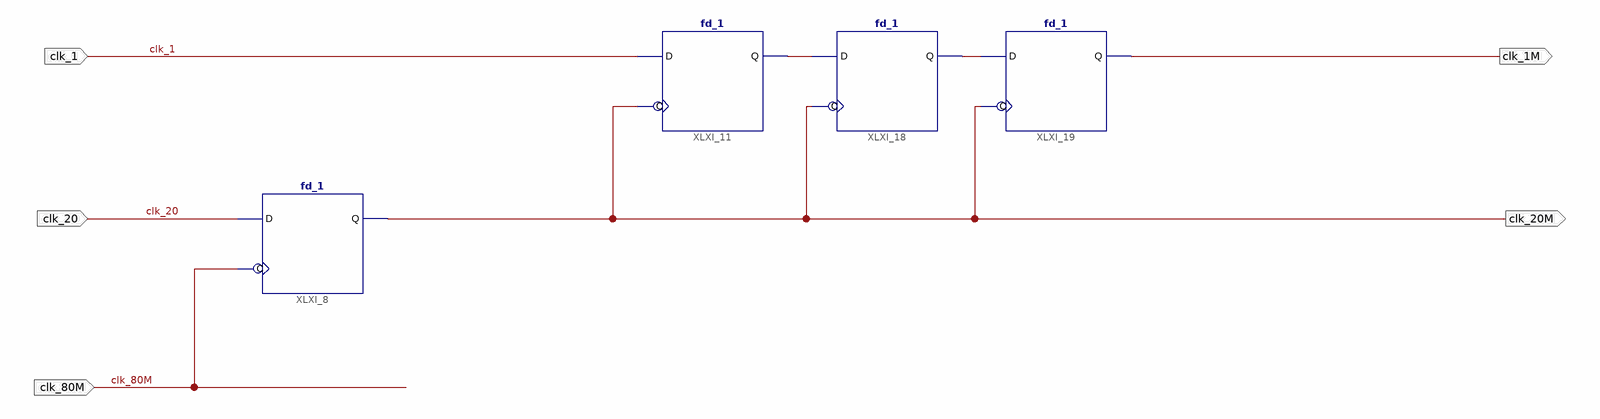
[diagram p0: schematic sheet 1]
// Xilinx ISE schematic Sync.sch (spartan3a) as structural Verilog: 4 symbols, 5 ports
module Sync (
  input  clk_80M,
  input  clk_20,
  input  clk_1,
  output clk_20M,
  output clk_1M
);

  wire XLXN_7, XLXN_8;

  fd_1 XLXI_8 (.C(clk_80M), .D(clk_20), .Q(clk_20M));
  fd_1 XLXI_11 (.C(clk_20M), .D(clk_1), .Q(XLXN_7));
  fd_1 XLXI_18 (.C(clk_20M), .D(XLXN_7), .Q(XLXN_8));
  fd_1 XLXI_19 (.C(clk_20M), .D(XLXN_8), .Q(clk_1M));
endmodule
